# Altium project GatewayRPICM5.PrjPcb (part 2 of 2)
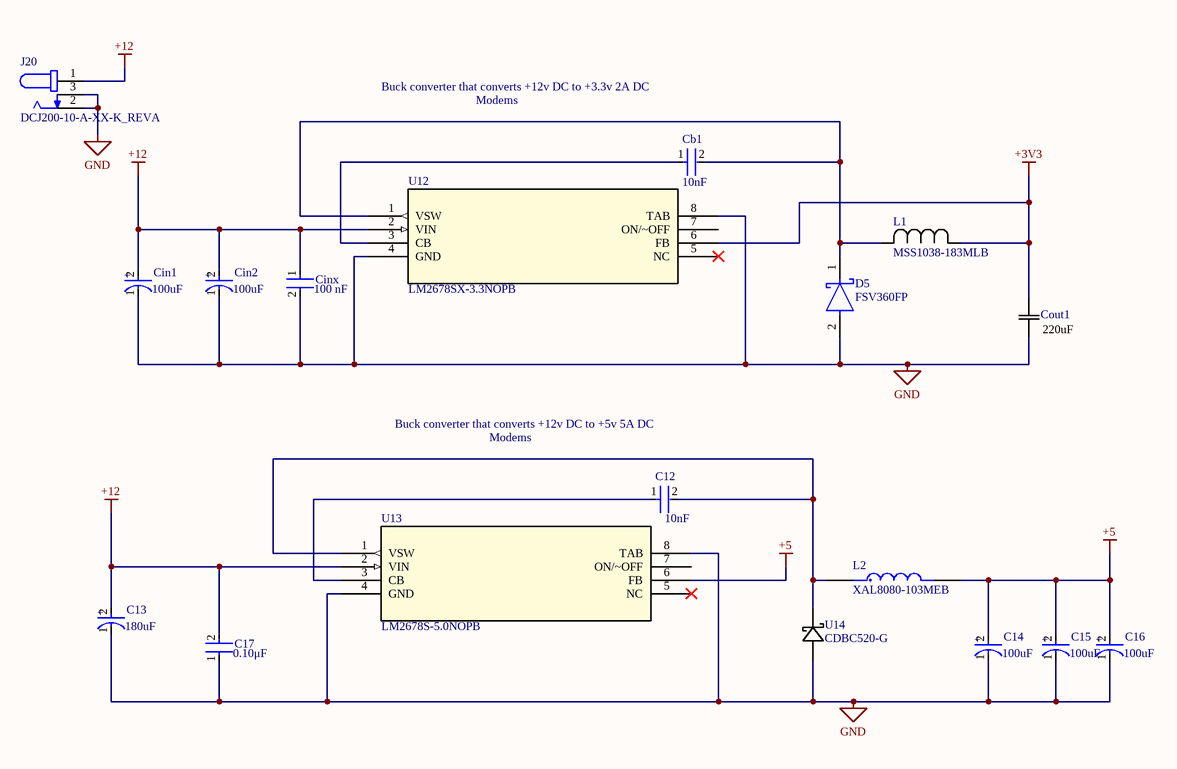
[diagram p9: Power.SchDoc]

## Nets that join several sheets
+3V3: SD Card (U4.5), Ethernet (R13.1), Indicators (U6.5 U10.5 U11.5), RTC (D2.1), Bus (6 pins), Power (Cout1.2 L1.1 U12.6)
+5: GPIOs RPI CM (6 pins), HDMI (C3.1 U5.1), USB (C8.2 R16.2), Power (5 pins)
GND: GPIOs RPI CM (55 pins), SD Card (10 pins), Ethernet (7 pins), HDMI (9 pins), Indicators (6 pins), USB (8 pins), RTC (5 pins), Bus (6 pins), Power (17 pins)
1-D_N: GPIOs RPI CM (U1.136), USB (J4.2)
1-D_P: GPIOs RPI CM (U1.134), USB (J4.3)
1-Rx_N: GPIOs RPI CM (U1.128), USB (J4.6)
1-Rx_P: GPIOs RPI CM (U1.130), USB (J4.5)
1-Tx_N: GPIOs RPI CM (U1.140), USB (J4.9)
1-Tx_P: GPIOs RPI CM (U1.142), USB (J4.8)
CK_N: GPIOs RPI CM (U1.190), HDMI (J5.12)
CK_P: GPIOs RPI CM (U1.188), HDMI (J5.10)
D0_N: GPIOs RPI CM (U1.184), HDMI (J5.9)
D0_P: GPIOs RPI CM (U1.182), HDMI (J5.7)
D1_N: GPIOs RPI CM (U1.178), HDMI (J5.6)
D1_P: GPIOs RPI CM (U1.176), HDMI (J5.4)
D2_N: GPIOs RPI CM (U1.172), HDMI (J5.3)
D2_P: GPIOs RPI CM (U1.170), HDMI (J5.1)
Modem Reset: GPIOs RPI CM (U1.92 U1.100), Indicators (U10.2), Bus (6 pins)
NetJ3_1: GPIOs RPI CM (U1.69), SD Card (J3.1)
NetJ3_2: GPIOs RPI CM (U1.61), SD Card (J3.2)
NetJ3_3: GPIOs RPI CM (U1.62), SD Card (J3.3)
NetJ3_5: GPIOs RPI CM (U1.57), SD Card (J3.5)
NetJ3_7: GPIOs RPI CM (U1.63), SD Card (J3.7)
NetJ3_8: GPIOs RPI CM (U1.67), SD Card (J3.8)
NetJ5_13: GPIOs RPI CM (U1.151), HDMI (J5.13)
NetJ5_15: GPIOs RPI CM (U1.200), HDMI (J5.15)
NetJ5_16: GPIOs RPI CM (U1.199), HDMI (J5.16)
NetJ5_19: GPIOs RPI CM (U1.153), HDMI (J5.19)
NetLabel1: GPIOs RPI CM (U1.50), Bus (J7.1 J12.1 J13.1)
NetLabel2: GPIOs RPI CM (U1.49), Bus (J7.2 J12.2 J13.2)
NetLabel3: GPIOs RPI CM (U1.29), Bus (J7.3 J12.3 J13.3)
NetLabel4: GPIOs RPI CM (U1.25), Bus (J7.4 J12.4 J13.4)
NetLabel5: GPIOs RPI CM (U1.24), Bus (J7.5 J12.5 J13.5)
NetLabel6: GPIOs RPI CM (U1.27), Bus (J7.6 J12.6 J13.6)
NetLabel7: GPIOs RPI CM (U1.37), Bus (J6.1 J8.1 J18.1)
NetLabel8: GPIOs RPI CM (U1.39), Bus (J6.2 J8.2 J18.2)
NetLabel9: GPIOs RPI CM (U1.58), Bus (J6.3 J8.3 J18.3)
NetLabel10: GPIOs RPI CM (U1.38), Bus (J6.4 J8.4 J18.4)
NetLabel12: GPIOs RPI CM (U1.40), Bus (J6.5 J8.5 J18.5)
NetLabel13: GPIOs RPI CM (U1.44), Bus (J6.6 J8.6 J18.6)
NetLabel14: GPIOs RPI CM (U1.34), Bus (6 pins)
NetLabel15: GPIOs RPI CM (U1.54), Bus (6 pins)
NetLabel16: GPIOs RPI CM (U1.28), Bus (6 pins)
NetLabel17: GPIOs RPI CM (U1.31), Bus (6 pins)
NetLabel18: GPIOs RPI CM (U1.55), Bus (6 pins)
NetR1_1: GPIOs RPI CM (U1.15), Ethernet (R1.1)
NetR2_1: GPIOs RPI CM (U1.17), Ethernet (R2.1)
NetU1_75: GPIOs RPI CM (U1.75), SD Card (U4.4)
NetU1_80: GPIOs RPI CM (U1.80), RTC (U8.6)
NetU1_82: GPIOs RPI CM (U1.82), RTC (U8.5)
NetU1_95: GPIOs RPI CM (U1.95), Indicators (U6.2)
NetU1_99: GPIOs RPI CM (U1.99), Indicators (U11.2), RTC (U9.4)
NetU1_111: GPIOs RPI CM (U1.111), USB (U7.3)
TRD0_N: GPIOs RPI CM (U1.10), Ethernet (J2.2 U3.4)
TRD0_P: GPIOs RPI CM (U1.12), Ethernet (J2.1 U3.5)
TRD1_N: GPIOs RPI CM (U1.6), Ethernet (J2.6 U3.2)
TRD1_P: GPIOs RPI CM (U1.4), Ethernet (J2.3 U3.1)
TRD2_N: GPIOs RPI CM (U1.9), Ethernet (J2.8 U2.4)
TRD2_P: GPIOs RPI CM (U1.11), Ethernet (J2.7 U2.5)
TRD3_N: GPIOs RPI CM (U1.5), Ethernet (J2.10 U2.2)
TRD3_P: GPIOs RPI CM (U1.3), Ethernet (J2.9 U2.1)